# Altium schematic sheet CONNECTORS.SchDoc
size A4; SheetNumber: 8; SheetTotal: 8
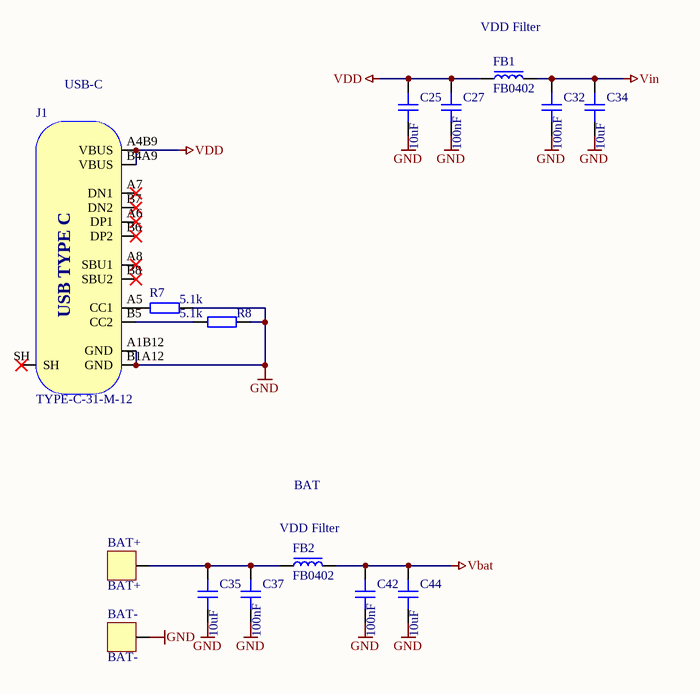
[diagram p0: CONNECTORS.SchDoc]

## Parts
BAT+  BAT+  [PAD_SQ_2MM]  (no BOM)
BAT-  BAT-  [PAD_SQ_2MM]  (no BOM)
C25  value 10uF  [CAP_0402]  (hidden comment: C0402_10V)
C27  value 100nF  [CAP_0402]  (hidden comment: C0402_10V)
C32  value 100nF  [CAP_0402]  (hidden comment: C0402_10V)
C34  value 10uF  [CAP_0402]  (hidden comment: C0402_10V)
C35  value 10uF  [CAP_0402]  (hidden comment: C0402_10V)
C37  value 100nF  [CAP_0402]  (hidden comment: C0402_10V)
C42  value 100nF  [CAP_0402]  (hidden comment: C0402_10V)
C44  value 10uF  [CAP_0402]  (hidden comment: C0402_10V)
FB1  FB0402  [FB_0402]
FB2  FB0402  [FB_0402]
J1  TYPE-C-31-M-12  [TYPE-C-31-M-12]
R7  value 5.1k  [RES_0402]  (hidden comment: R0402)
R8  value 5.1k  [RES_0402]  (hidden comment: R0402)

## Nets
GND: BAT-.1 C25.1 C27.1 C32.1 C34.1 C35.1 C37.1 C42.1 C44.1 J1.A1B12(GND) J1.B1A12(GND) R7.2 R8.2
Vbat: C42.2 C44.2 FB2.2
VDD: C25.2 C27.2 FB1.1 J1.A4B9(VBUS) J1.B4A9(VBUS)
Vin: C32.2 C34.2 FB1.2
NetBAT+_1: BAT+.1 C35.2 C37.2 FB2.1
NetJ1_A5: J1.A5(CC1) R7.1
NetJ1_B5: J1.B5(CC2) R8.1

Not connected (* = marked no-connect by the designer): J1 A6(DP1)* A7(DN1)* A8(SBU1)* B6(DP2)* B7(DN2)* B8(SBU2)* SH*

## Notes on the sheet
- VDD Filter
- USB-C
- BAT
- (near FB2) VDD Filter
- (in symbol TYPE-C-31-M-12) USB TYPE C

## Library data of the parts
BAT+ BAT- = PAD_SQ_2MM: Test Point Square 2mm
C25 C27 C32 C34 C35 C37 C42 C44 = CAP_0402_10V: Capacitor SMD 0402 10V
FB1 FB2 = FB_0402: Ferrite Bead SMD 0402
J1 = TYPE-C-31-M-12: USB Type C Connector Horizontal SMT; Manufacturer: Koren Hroparts; Manufacturer Part Number: TYPE-C-31-M-12
R7 R8 = RES_0402: Resistor SMD 0402; Manufacturer: *; Manufacturer Part Number: *; Distributor Link: *